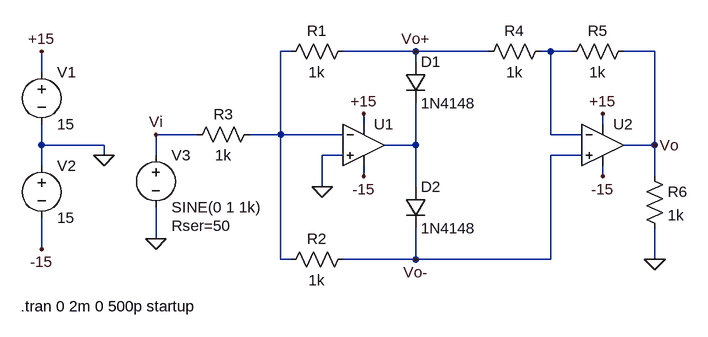
[diagram p0: schematic Fullwave.asc]
Fullwave.asc, the LTspice schematic file:
Version 4
SHEET 1 880 680
WIRE 80 32 64 32
WIRE 272 32 160 32
WIRE 384 32 272 32
WIRE 480 32 464 32
WIRE 512 32 480 32
WIRE 640 32 592 32
WIRE 272 48 272 32
WIRE -304 64 -304 32
WIRE 192 144 192 128
WIRE 560 144 560 128
WIRE -64 160 -128 160
WIRE 64 160 64 32
WIRE 64 160 16 160
WIRE 160 160 64 160
WIRE 480 160 480 32
WIRE 528 160 480 160
WIRE -304 176 -304 144
WIRE -208 176 -304 176
WIRE 272 176 272 112
WIRE 272 176 224 176
WIRE 640 176 640 32
WIRE 640 176 592 176
WIRE -208 192 -208 176
WIRE -128 192 -128 160
WIRE 160 192 128 192
WIRE 528 192 480 192
WIRE -304 208 -304 176
WIRE 192 224 192 208
WIRE 560 224 560 208
WIRE 640 224 640 176
WIRE 128 240 128 192
WIRE 272 240 272 176
WIRE -128 320 -128 272
WIRE -304 336 -304 288
WIRE 64 352 64 160
WIRE 80 352 64 352
WIRE 272 352 272 304
WIRE 272 352 160 352
WIRE 480 352 480 192
WIRE 480 352 272 352
WIRE 640 352 640 304
FLAG 128 240 0
FLAG -208 192 0
FLAG -304 32 +15
FLAG -304 336 -15
FLAG 192 128 +15
FLAG 192 224 -15
FLAG -128 320 0
FLAG 272 32 Vo+
FLAG 272 352 Vo-
FLAG -128 160 Vi
FLAG 560 128 +15
FLAG 560 224 -15
FLAG 640 352 0
FLAG 640 176 Vo
SYMBOL OpAmps\\UniversalOpAmp 192 176 R0
SYMATTR InstName U1
SYMATTR Value2 Avol=100k GBW=1.2Meg Vos=.6m
SYMATTR SpiceLine En=3u Enk=35n In=0 Ink=0 Rin=500Meg
SYMBOL diode 256 48 R0
SYMATTR InstName D1
SYMATTR Value 1N4148
SYMBOL diode 256 240 R0
SYMATTR InstName D2
SYMATTR Value 1N4148
SYMBOL res 176 16 R90
WINDOW 0 0 56 VBottom 2
WINDOW 3 32 56 VTop 2
SYMATTR InstName R1
SYMATTR Value 1k
SYMBOL res 176 336 R90
WINDOW 0 0 56 VBottom 2
WINDOW 3 32 56 VTop 2
SYMATTR InstName R2
SYMATTR Value 1k
SYMBOL voltage -304 48 R0
WINDOW 123 0 0 Left 0
WINDOW 39 0 0 Left 0
SYMATTR InstName V1
SYMATTR Value 15
SYMBOL voltage -304 192 R0
WINDOW 123 0 0 Left 0
WINDOW 39 0 0 Left 0
SYMATTR InstName V2
SYMATTR Value 15
SYMBOL voltage -128 176 R0
WINDOW 123 0 0 Left 0
WINDOW 39 24 124 Left 2
SYMATTR SpiceLine Rser=50
SYMATTR InstName V3
SYMATTR Value SINE(0 1 1k)
SYMBOL res 32 144 R90
WINDOW 0 0 56 VBottom 2
WINDOW 3 32 56 VTop 2
SYMATTR InstName R3
SYMATTR Value 1k
SYMBOL res 480 16 R90
WINDOW 0 0 56 VBottom 2
WINDOW 3 32 56 VTop 2
SYMATTR InstName R4
SYMATTR Value 1k
SYMBOL res 608 16 R90
WINDOW 0 0 56 VBottom 2
WINDOW 3 32 56 VTop 2
SYMATTR InstName R5
SYMATTR Value 1k
SYMBOL res 624 208 R0
SYMATTR InstName R6
SYMATTR Value 1k
SYMBOL OpAmps\\UniversalOpAmp 560 176 R0
SYMATTR InstName U2
SYMATTR Value2 Avol=100k GBW=1.2Meg Vos=.6m
SYMATTR SpiceLine En=3u Enk=35n In=0 Ink=0 Rin=500Meg
TEXT -336 424 Left 2 !.tran 0 2m 0 500p startup

The netlist it stands for:
* Fullwave.asc
XU1 0 N001 +15 -15 N003 level1 Avol=100k GBW=1.2Meg Vos=.6m En=3u Enk=35n In=0 Ink=0 Rin=500Meg  ; pins In+ In- V+ V- OUT
D1 Vo+ N003 1N4148
D2 N003 Vo- 1N4148
R1 Vo+ N001 1k
R2 Vo- N001 1k
V1 +15 0 15
V2 0 -15 15
V3 Vi 0 SINE(0 1 1k) Rser=50
R3 N001 Vi 1k
R4 N002 Vo+ 1k
R5 Vo N002 1k
R6 Vo 0 1k
XU2 Vo- N002 +15 -15 Vo level1 Avol=100k GBW=1.2Meg Vos=.6m En=3u Enk=35n In=0 Ink=0 Rin=500Meg  ; pins In+ In- V+ V- OUT
.model D D
.lib standard.dio
.tran 0 2m 0 500p startup
.lib UniversalOpAmp1.lib
.backanno
.end